# EAGLE design LI-ION Wavebubble Board (EAGLE 5.11)
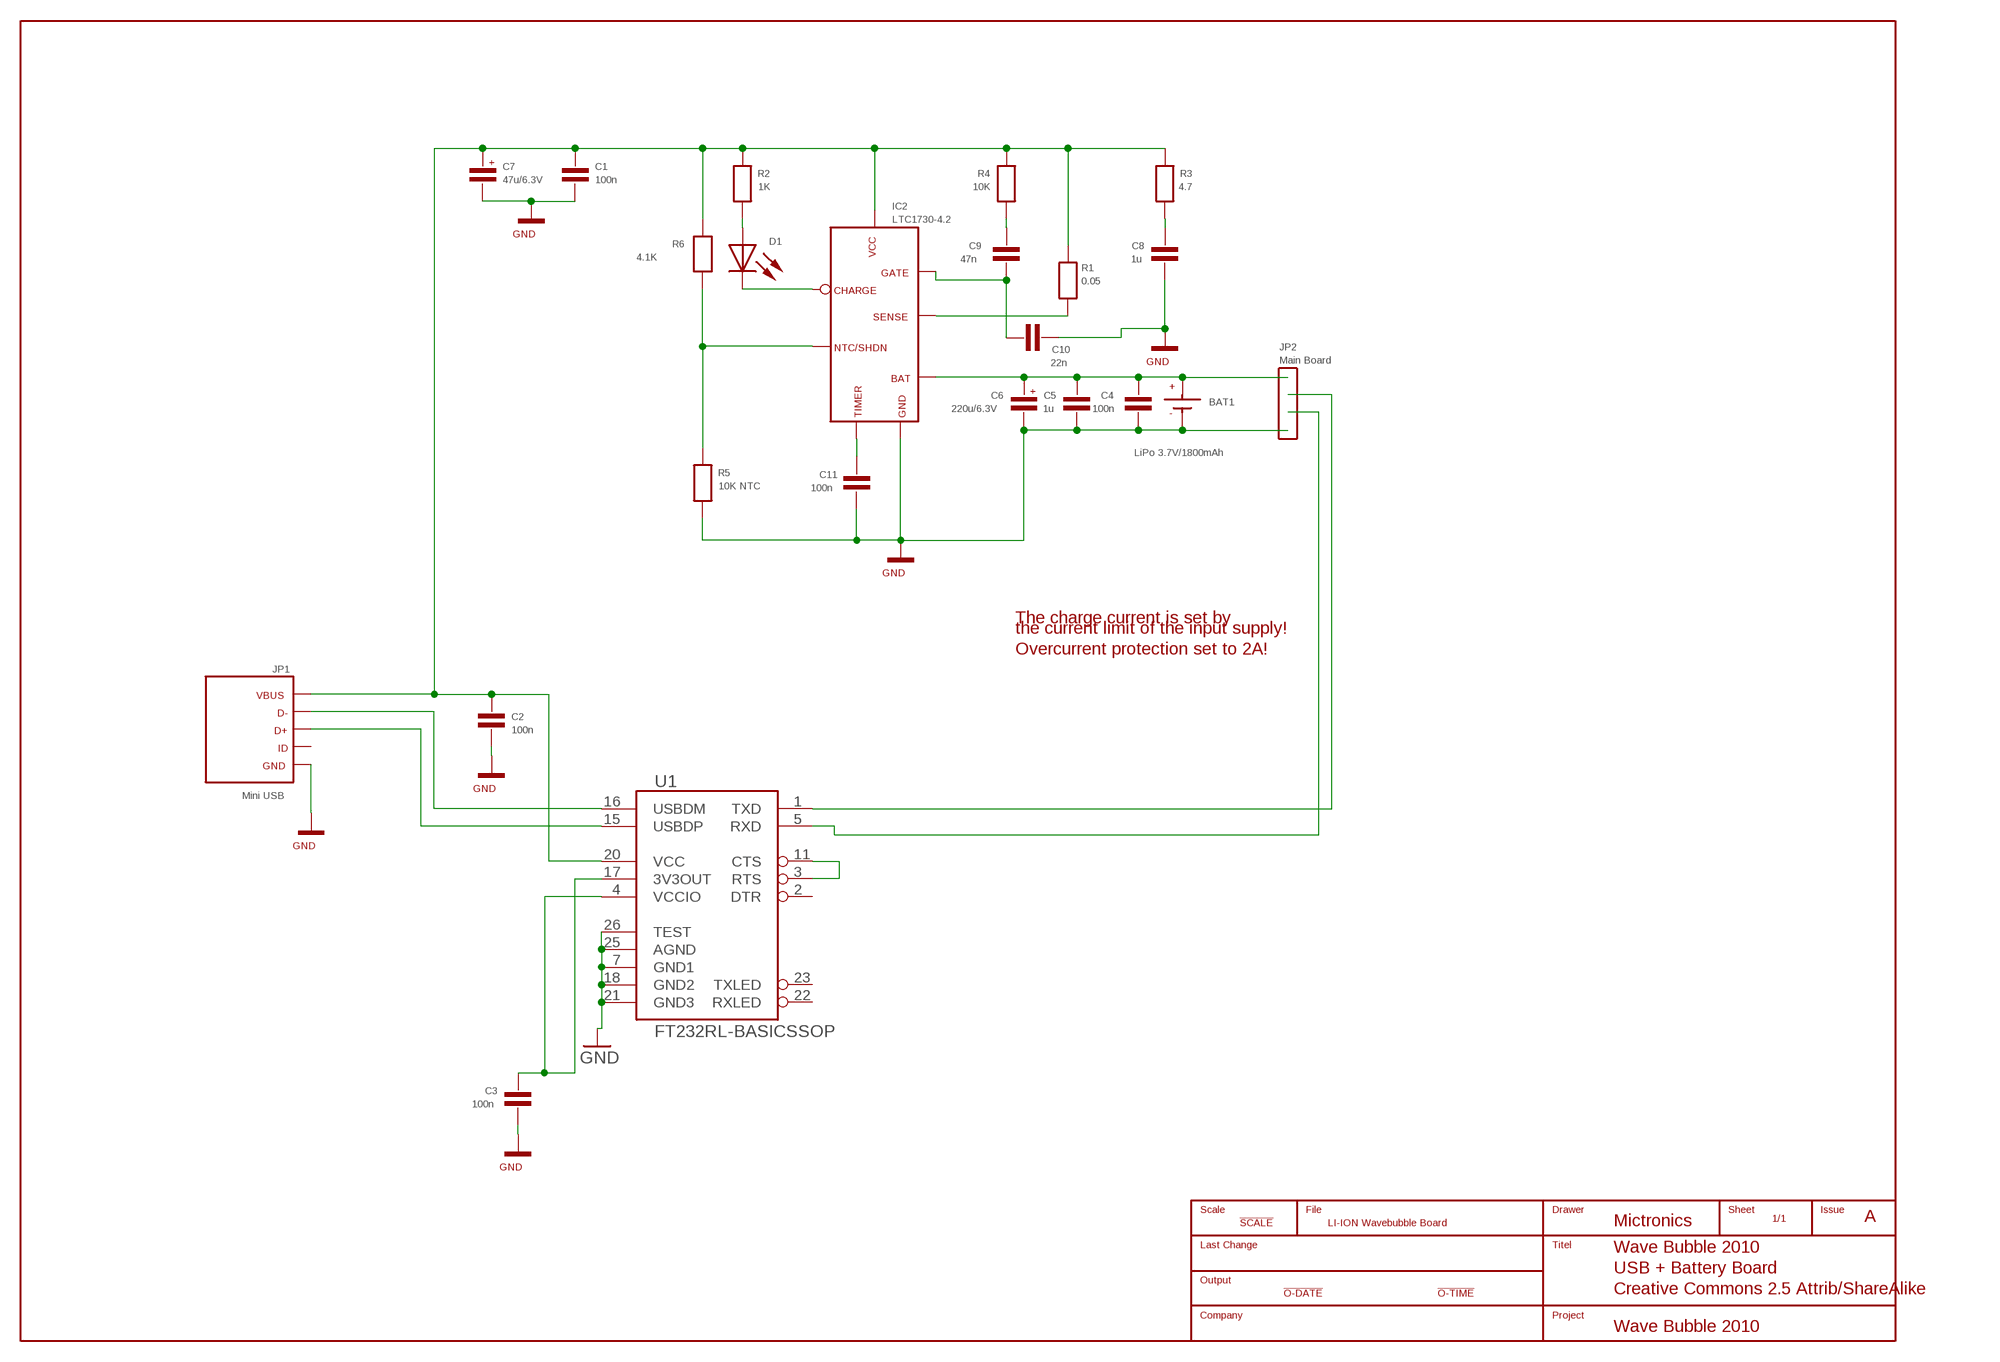
[diagram p0: schematic, sheet 1]

## Parts
BAT1  LiPo 3.7V/1800mAh  BAT1  [BAT1]
C1  100n  C1  [C1]
C2  100n  C2  [C2]
C3  100n  C3  [C3]
C4  100n  C4  [C4]
C5  1u  C5  [C5]
C6  220u/6.3V  C6  [C6]
C7  47u/6.3V  C7  [C7]
C8  1u  C8  [C8]
C9  47n  C9  [C9]
C10  22n  C10  [C10]
C11  100n  C11  [C11]
D1  GREEN  D1  [D1]
IC2  LTC1730-4.2  IC2  [IC2]
JP1  Mini USB  JP1  [JP1]
JP2  Main Board  JP2  [JP2]
R1  0.05  R1  [R1]
R2  1K  R2  [R2]
R3  4.7  R3  [R3]
R4  10K  R4  [R4]
R5  10K NTC  R5  [R5]
R6  4.1K  R6  [R6]
U1  FT232RL-BASICSSOP  [SSOP28DB]

## Nets
1: C8.1(+) R3.1
A: D1.1(A) R2.1
CEL: BAT1.1 C4.1 C5.1(+) C6.1(+) IC2.8(BAT) JP2.1
CHARGE: D1.2(K) IC2.3(CHARGE)
GND: BAT1.2 C1.2 C2.2 C3.2 C4.2 C5.2(-) C6.2(-) C7.2(-) C8.2(-) C10.2 C11.2 IC2.4(GND) JP1.5(GND) JP2.4 R5.1 U1.7(GND1) U1.18(GND2) U1.21(GND3) U1.25(AGND) U1.26(TEST) ; supply symbol labelled !GND
N$12: U1.3(RTS) U1.11(CTS)
NTC/SHDN: IC2.6(NTC/SHDN) R5.2 R6.1
RXD: JP2.3 U1.5(RXD)
SENSE: IC2.1(SENSE) R1.2
SIG$12: C9.2 C10.1 IC2.7(GATE)
SIG$13: C9.1 R4.1
TIMER: C11.1 IC2.5(TIMER)
TXD: JP2.2 U1.1(TXD)
USBDM: JP1.2(D-) U1.16(USBDM)
USBDP: JP1.3(D+) U1.15(USBDP)
VBUS: C1.1 C2.1 C7.1(+) IC2.2(VCC) JP1.1(VBUS) R1.1 R2.2 R3.2 R4.2 R6.2 U1.20(VCC)
VCCIO: C3.1 U1.4(VCCIO) U1.17(3V3OUT)
Unconnected: JP1.4(ID) U1.2(DTR) U1.22(RXLED) U1.23(TXLED)

## Notes on the sheet
- The charge current is set by
- the current limit of the input supply!
- Overcurrent protection set to 2A!
- Mictronics | A
- Wave Bubble 2010
- USB + Battery Board
- Creative Commons 2.5 Attrib/ShareAlike
- Wave Bubble 2010

## Library data of the parts
BAT1 = wave_bubble-usb_batt_LTC1730:BAT1: Akkumulator, Primärzelle, Primärelement (BATTERIE)
C1 = wave_bubble-usb_batt_LTC1730:C1: SMD VS KONDENSATOR 0.1 UF 1206 50 V SMD-Vielschicht-Keramik-Kondensatoren Nennspannung 50 V - 1 pF - 1000 pF NPO; 1200 pF -1 µF X7R. Toleranz 1 pF ... 1000 pF: 5%; 1200 pF ... 1 µF: ±10%. Baugröße 1206 ; Wert 0,1 µ
C2 = wave_bubble-usb_batt_LTC1730:C2: SMD VS KONDENSATOR 0.1 UF 1206 50 V SMD-Vielschicht-Keramik-Kondensatoren Nennspannung 50 V - 1 pF - 1000 pF NPO; 1200 pF -1 µF X7R. Toleranz 1 pF ... 1000 pF: 5%; 1200 pF ... 1 µF: ±10%. Baugröße 1206 ; Wert 0,1 µ
C3 = wave_bubble-usb_batt_LTC1730:C3: SMD VS KONDENSATOR 0.1 UF 1206 50 V SMD-Vielschicht-Keramik-Kondensatoren Nennspannung 50 V - 1 pF - 1000 pF NPO; 1200 pF -1 µF X7R. Toleranz 1 pF ... 1000 pF: 5%; 1200 pF ... 1 µF: ±10%. Baugröße 1206 ; Wert 0,1 µ
C4 = wave_bubble-usb_batt_LTC1730:C4: SMD VS KONDENSATOR 0.1 UF 1206 50 V SMD-Vielschicht-Keramik-Kondensatoren Nennspannung 50 V - 1 pF - 1000 pF NPO; 1200 pF -1 µF X7R. Toleranz 1 pF ... 1000 pF: 5%; 1200 pF ... 1 µF: ±10%. Baugröße 1206 ; Wert 0,1 µ
C5 = wave_bubble-usb_batt_LTC1730:C5: SMD ELKO TANTAL KONDENSATOR 22 UF 10% Kapazitätstoleranz bei allen Elektrolyt-Kondensatoren ±10% CN µF 22 ; UN bis 85°C V- 16 ; Baugröße C ; Typ B45196-H3226-K30
C6 = wave_bubble-usb_batt_LTC1730:C6: SMD - ELKO 100 UF/35V Miniatur SMD-Elektrolyt-Kondensatoren Sehr kleine Abm., für allgemeine Anwendung. Polaritätskennzeichnung (-) erfolgt durch einen Strich. Temperaturbereich: -40 bis +85 °C. Toleranz ±20%. µF/Volt 100/35 ; Durchmesser x H mm 10 x
C7 = wave_bubble-usb_batt_LTC1730:C7: SMD ELKO 47 UF 6.3 V Miniatur SMD-Elektrolyt-Kondensatoren Sehr kleine Abm., für allgemeine Anwendung. Polaritätskennzeichnung (-) erfolgt durch einen Strich. Temperaturbereich: -40 bis +85 °C. Toleranz ±20%. µF/Volt 47/6,3 ; Durchmesser x H mm 5,0 x 6,
C8 = wave_bubble-usb_batt_LTC1730:C8: SMD ELKO TANTAL KONDENSATOR 22 UF 10% Kapazitätstoleranz bei allen Elektrolyt-Kondensatoren ±10% CN µF 22 ; UN bis 85°C V- 16 ; Baugröße C ; Typ B45196-H3226-K30
C9 = wave_bubble-usb_batt_LTC1730:C9: SMD VS KONDENSATOR 0.1 UF 1206 50 V SMD-Vielschicht-Keramik-Kondensatoren Nennspannung 50 V - 1 pF - 1000 pF NPO; 1200 pF -1 µF X7R. Toleranz 1 pF ... 1000 pF: 5%; 1200 pF ... 1 µF: ±10%. Baugröße 1206 ; Wert 0,1 µ
C10 = wave_bubble-usb_batt_LTC1730:C10: SMD VS KONDENSATOR 0.1 UF 1206 50 V SMD-Vielschicht-Keramik-Kondensatoren Nennspannung 50 V - 1 pF - 1000 pF NPO; 1200 pF -1 µF X7R. Toleranz 1 pF ... 1000 pF: 5%; 1200 pF ... 1 µF: ±10%. Baugröße 1206 ; Wert 0,1 µ
C11 = wave_bubble-usb_batt_LTC1730:C11: SMD VS KONDENSATOR 0.1 UF 1206 50 V SMD-Vielschicht-Keramik-Kondensatoren Nennspannung 50 V - 1 pF - 1000 pF NPO; 1200 pF -1 µF X7R. Toleranz 1 pF ... 1000 pF: 5%; 1200 pF ... 1 µF: ±10%. Baugröße 1206 ; Wert 0,1 µ
D1 = wave_bubble-usb_batt_LTC1730:D1: Leuchtdiode, SMD 1206, Diffus, grün
IC2 = wave_bubble-usb_batt_LTC1730:IC2
JP1 = wave_bubble-usb_batt_LTC1730:JP1: Mini-USB-Einbaukupplung Typ B, 5-polig, abgewinkelte Ausführung, für Leiterplatten, Surface-Mount-Technik (SMT) Durchgangswiderstand = 50 mO Bemessungsstrom 0,5 A Bemessungsspannung 5 V AC Prüfspannung 100 V/60 s Isolationswiderstand = 1 GO
JP2 = wave_bubble-usb_batt_LTC1730:JP2: Buchsenleiste 4-polig RM2,54
R1 = wave_bubble-usb_batt_LTC1730:R1: SMD-Widerstand 0-Ohm
R2 = wave_bubble-usb_batt_LTC1730:R2: SMD-Widerstand 0-Ohm
R3 = wave_bubble-usb_batt_LTC1730:R3: SMD-Widerstand 0-Ohm
R4 = wave_bubble-usb_batt_LTC1730:R4: SMD-Widerstand 0-Ohm
R5 = wave_bubble-usb_batt_LTC1730:R5: SMD-Widerstand 0-Ohm
R6 = wave_bubble-usb_batt_LTC1730:R6: SMD-Widerstand 0-Ohm
U1 = SparkFun:FT232RL-BASIC: USB UART This is the simplified version of the FT232RL unit. Only what you need, nothing you don't. Spark Fun Electronics SKU : COM-00650

## Board
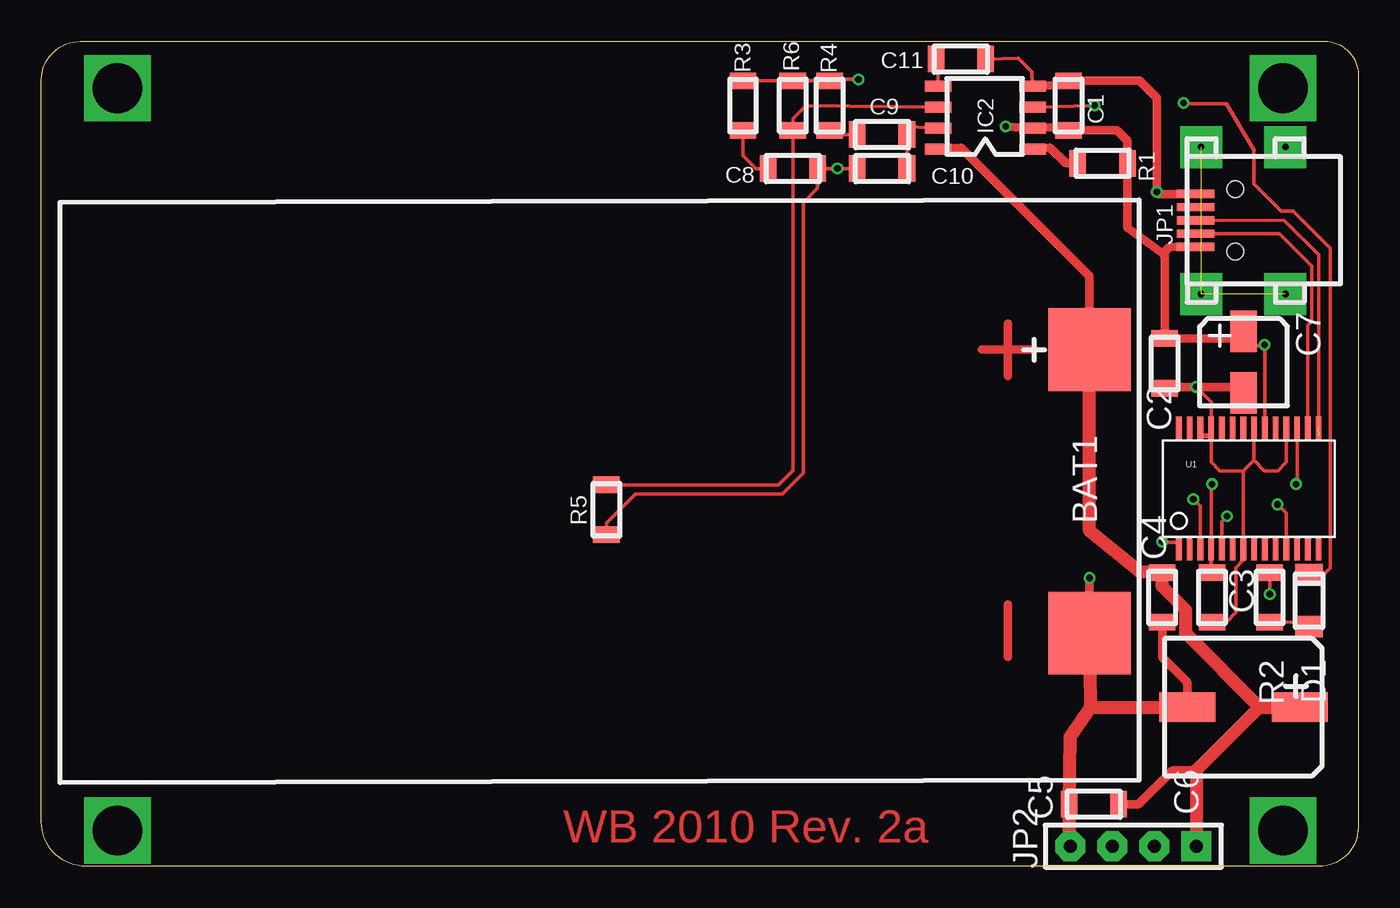
[diagram p1: board, top side]
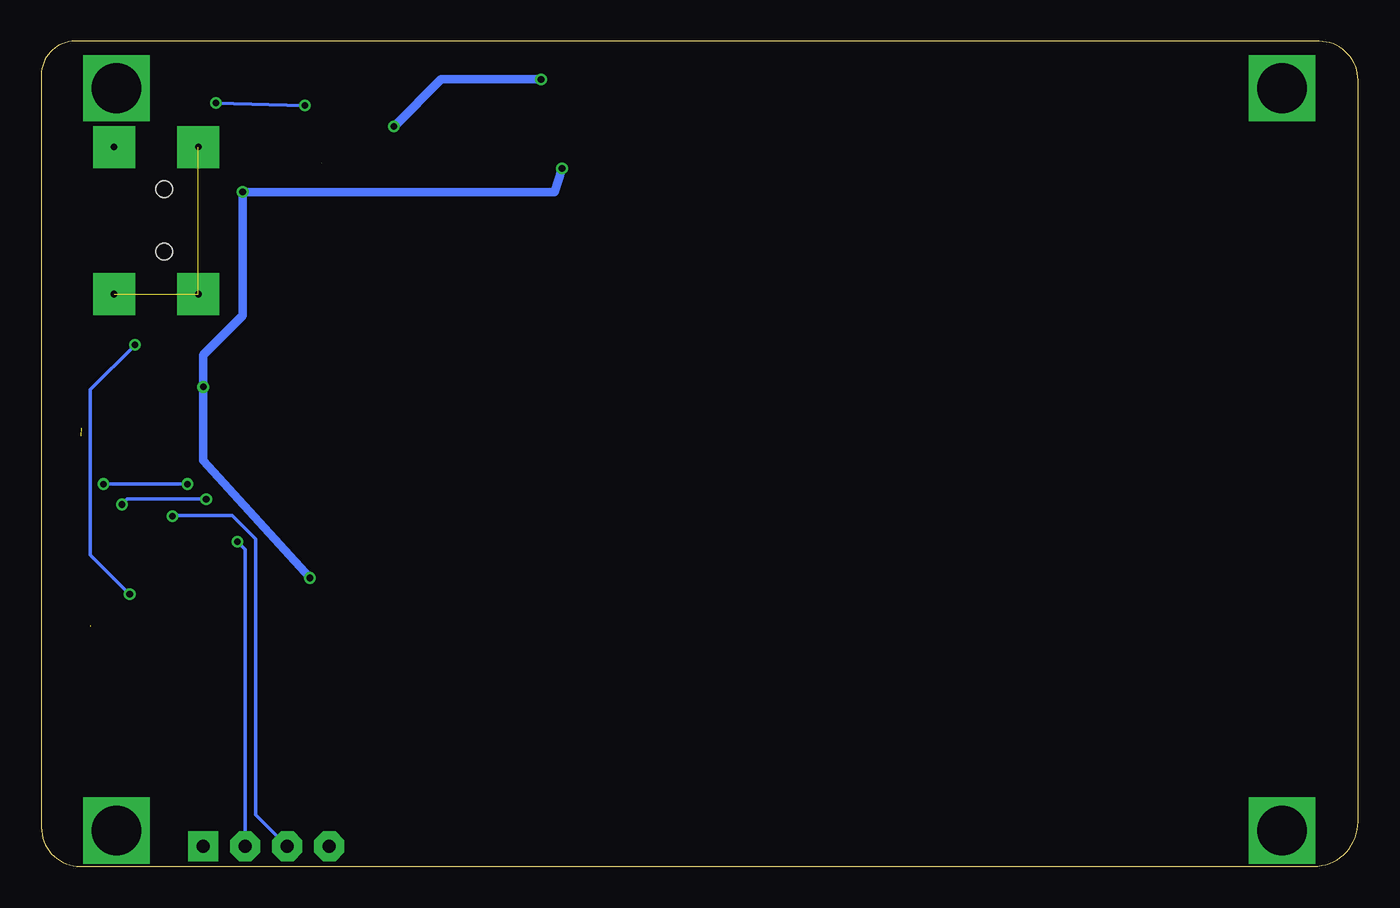
[diagram p2: board, bottom side, seen from below]

Size 79.64 x 49.9 mm. Coordinates in mm from the lower left corner, seen from the top.
Outline: 0,47.54 arc-90 2.36,49.9 77.62,49.9 arc-90 79.64,47.88 79.64,2.35 arc-90 77.29,0 2.69,0 arc-90 0,2.69 0,47.54
Copper layers (1*16): Top 0.035mm / dielectric 1.5mm / Bottom 0.035mm
Design rules "ITead_rule": minimum track width 6mil, minimum drill 12mil, track to track 6mil, track to pad 6mil, pad to pad 6mil, via to via 6mil, smd to smd 0mil, copper to edge 10mil, drill to drill 10mil, minimum pad ring 10mil, minimum via ring 6mil, stop-mask expansion 2mil, vias tented up to drill 100mil, thermal gap 10mil

### Footprints (pad centres in the part's own frame; a part is rotated, then mirrored left to right if it is on the bottom)
BAT1 = smd 5 x 5: 1 9.684,-29.21; 2 -7.461,-29.21
C1 = smd 1 x 1.6: 1 -1.5,0; 2 1.5,0
C2 = smd 1 x 1.6: 1 1.5,0; 2 -1.5,0
C3 = smd 1 x 1.6: 1 1.5,0; 2 -1.5,0
C4 = smd 1 x 1.6: 1 1.5,0; 2 -1.5,0
C5 = smd 1.6 x 1: 1 0,-1.5; 2 0,1.5
C6 = smd 1.8 x 3.4: 1 0,-3.4; 2 0,3.4
C7 = smd 2.5 x 1.6: 1 1.865,0; 2 -1.865,0
C8 = smd 1.6 x 1: 1 0,1.5; 2 0,-1.5
C9 = smd 1.6 x 1: 1 0,1.5; 2 0,-1.5
C10 = smd 1.6 x 1: 1 0,-1.5; 2 0,1.5
C11 = smd 1.6 x 1: 1 0,1.5; 2 0,-1.5
D1 = smd 1.315 x 1.68: 1 -1.567,0; 2 1.567,0
IC2 = smd 0.65 x 1.6: 1 0,0; 2 1.27,0; 3 2.54,0; 4 3.81,0; 5 3.81,5.715; 6 2.54,5.715; 7 1.27,5.715; 8 0,5.715
JP1 = smd 0.5 x 2.25: 1 0,0; 2 0.8,0; 3 1.6,0; 4 2.4,0; 5 3.2,0 | hole 1: 3.482,-2.4; -0.282,-2.4
JP2 = drill 0.8 pad 1.8 square: 1 0,-3.81 | drill 0.8 pad 1.8 octagon: 2 0,-1.27; 3 0,1.27; 4 0,3.81
R1 = smd 1.6 x 1: 1 0,-1.5; 2 0,1.5
R2 = smd 1 x 1.6: 1 -1.5,0; 2 1.5,0
R3 = smd 1 x 1.6: 1 -1.5,0; 2 1.5,0
R4 = smd 1 x 1.6: 1 -1.5,0; 2 1.5,0
R5 = smd 1 x 1.6: 1 -1.5,0; 2 1.5,0
R6 = smd 1 x 1.6: 1 -1.5,0; 2 1.5,0
SSOP28DB = smd 0.348 x 1.397: 1 -4.225,-3.656; 2 -3.575,-3.656; 3 -2.925,-3.656; 4 -2.275,-3.656; 5 -1.625,-3.656; 6 -0.975,-3.656; 7 -0.325,-3.656; 8 0.325,-3.656; 9 0.975,-3.656; 10 1.625,-3.656; 11 2.275,-3.656; 12 2.925,-3.656; 13 3.575,-3.656; 14 4.225,-3.656; 15 4.225,3.656; 16 3.575,3.656; 17 2.925,3.656; 18 2.275,3.656; 19 1.625,3.656; 20 0.975,3.656; 21 0.325,3.656; 22 -0.325,3.656; 23 -0.975,3.656; 24 -1.625,3.656; 25 -2.275,3.656; 26 -2.925,3.656; 27 -3.575,3.656; 28 -4.225,3.656

### Placement (x,y rotation side)
BAT1  34.18,21.57 90 top
C1  62.12,46.01 90 top
C2  67.94,30.42 90 top
C3  70.8,16.26 90 top
C4  67.79,16.26 90 top
C5  63.66,3.75 90 top
C6  72.71,9.62 90 top
C7  72.71,30.5 90 top
C8  45.45,42.2 90 top
C9  50.85,44.27 90 top
C10  50.85,42.2 90 top
C11  55.61,48.82 90 top
D1  76.68,16.06 90 top
IC2  59.95,43.37 90 top
JP1  69.81,37.47 90 top
JP2  66.04,1.21 90 top
R1  64.19,42.52 90 top
R2  74.29,16.26 90 top
R3  42.44,46.01 90 top
R4  47.68,46.01 90 top
R5  34.18,21.57 90 top
R6  45.45,46.01 90 top
U1  73.01,22.84 0 top

### Tracks (layer width: path | path; a pad name or v marks a point on that pad's centre or on a via)
1
  Top 0.203: R3.1 42.44,43 43.23,42.2 C8.1
A  (1 unrouted)
  Top 0.203: 74.36,14.72 R2.1 76.45,14.79 76.68,14.57
CEL
  Top 0.5: 69.85,5.81 68.42,5.81 66.36,3.75 C5.1 | BAT1.1 63.39,35.7 55.61,43.47 IC2.8
  Top 0.8: 73.66,9.62 C6.1 | 73.66,9.62 69.85,5.81 JP2.1 | 73.66,9.62 69.21,14.07 69.21,15.5 67.79,16.93 C4.1 66.44,17.79 63.39,20.3 BAT1.1
CHARGE  (via drill 0.4)
  Top 0.203: v63.71,46.01 IC2.3 | D1.2 77.61,17.7 77.95,18.04 77.95,37.41 75.72,39.63 74.99,39.63 73.33,41.29 73.33,43.35 71.66,46.14 69.06,46.14 v69.08,46.16
  Bottom 0.203: v69.08,46.16 v63.71,46.01
GND  (via drill 0.4)
  Top 0.203: 70.75,26.02 70.75,24.44 71.28,23.91 72.71,23.91 | 72.71,23.91 72.7,23.91 72.7,18.52 | 72.7,18.52 72.23,18.05 72.23,15.34 71.68,14.79 C3.2 | IC2.4 59.9,48.08 59.1,48.87 C11.2 | R5.1 34.18,20.77 35.93,22.52 44.82,22.52 46.09,23.79 46.09,40.14 46.95,41.01 C8.2 v48.15,42.2 C10.2 | 73.35,24.54 73.98,23.91 74.77,23.91 75.3,24.44 75.3,26.02 75.29,26.03 U1.18 | 72.71,23.91 73.33,24.54 73.35,24.54 | v69.85,28.99 70.75,28.09 70.75,26.02 | 72.7,18.52 72.69,18.53 U1.7 | U1.26 70.15,26.43 70.15,26.02 | 70.75,26.02 70.74,26.03 U1.25 | 73.35,26.02 73.34,26.03 U1.21 73.34,24.55 73.35,24.54
  Top 0.3: 70.75,26.02 70.15,26.02 70.1,26.02
  Top 0.5: C7.2 72.27,28.99 v69.85,28.99 68.02,28.99 C2.2 | 62.16,1.28 JP2.4 | C6.2 69.31,11.12 67.79,12.64 C4.2 | v63.39,17.44 BAT1.2 | IC2.4 61.89,47.28 C1.2 66.44,47.51 67.47,46.49 v67.47,40.79 67.55,40.66 JP1.5
  Top 0.8: BAT1.2 63.44,9.62 | 63.44,9.62 C6.2 | 63.44,9.62 62.21,7.84 C5.2 62.16,1.28
  Bottom 0.5: v63.39,17.44 69.85,24.55 v69.85,28.99 69.85,30.93 67.47,33.32 v67.47,40.79 48.62,40.79 v48.15,42.2
N$1  (via drill 3)
  other vias: 4.6,2.16
N$2  (via drill 3)
  other vias: 4.6,47.07
N$3  (via drill 3)
  other vias: 75.09,2.16
N$4  (via drill 3)
  other vias: 75.09,47.07
N$5
  Top 0.5: 56.88,31.25 60.06,31.25
N$6
  Top 0.5: 58.47,29.66 58.47,32.84
N$7
  Top 0.5: 58.47,12.68 58.47,15.85
N$8  (via drill 0.4 pad 2.54)
  other vias: 75.24,43.51
N$9  (via drill 0.4 pad 2.54)  (2 unrouted)
  other vias: 70.15,43.51 70.15,34.61 75.24,34.61
N$12  (via drill 0.4)
  Top 0.203: U1.3 70.09,21.79 v69.67,22.21 | v74.76,21.89 75.29,21.36 U1.11
  Bottom 0.203: v69.67,22.21 74.44,22.21 v74.76,21.89
NTC/SHDN
  Top 0.203: IC2.6 46.25,46.01 45.45,45.22 R6.1 45.45,23.95 44.57,23.07 R5.2
RXD  (via drill 0.4)
  Top 0.203: 71.4,19.2 U1.5 71.39,20.85 v71.72,21.18
  Bottom 0.203: JP2.3 66.67,3.12 66.67,19.79 68.1,21.21 71.36,21.21 v71.72,21.18 71.44,21.21
SENSE  (1 unrouted)
  Top 0.5: R1.2 61.96,42.52 61.01,43.47 IC2.1
SIG$12
  Top 0.203: IC2.7 52.44,44.74 52.35,44.66 C9.2 C10.1
SIG$13
  Top 0.203: C9.1 47.92,44.27 R4.1
TIMER
  Top 0.203: IC2.5 54.18,48.8 C11.1
TXD  (via drill 0.4)
  Top 0.203: v67.79,19.63 67.83,19.58 68.8,19.58 68.79,19.57 U1.1
  Bottom 0.203: v67.79,19.63 67.31,19.15 JP2.2
USBDM
  Top 0.203: JP1.2 74.87,38.26 76.83,36.3 76.83,32.96 76.6,32.73 76.6,26.02 76.59,26.03 U1.16
USBDP  (1 unrouted)
  Top 0.203: 77.25,26.02 77.25,36.99 75.18,39.06 JP1.3
VBUS  (via drill 0.4)
  Top 0.203: 74,31.51 U1.20 | v74.29,16.45 R2.2 | R4.2 R6.2 R3.2 | 47.76,47.6 v49.42,47.6 | 74,31.51 73.48,31.51 C7.1 | 74,31.51 v73.98,31.53 | U1.20 | U1.20 74,26.02
  Top 0.5: C7.1 72.34,31.92 C2.1 67.94,36.93 67.83,37.05 | 67.83,37.05 65.69,38.64 R1.1 65.69,43.88 65.05,44.51 C1.1 61.89,44.74 IC2.2 v58.31,44.74 | R4.2 47.76,47.6 | JP1.1 68.23,37.46 67.83,37.05
  Bottom 0.203: v73.98,31.53 76.68,28.83 76.68,18.83 v74.29,16.45
  Bottom 0.5: v58.31,44.74 55.45,47.6 v49.42,47.6
VCCIO  (via drill 0.4)
  Top 0.203: 70.75,17.84 C3.1 | 70.75,17.84 70.75,23.07 v70.8,23.12 | v75.88,23.12 75.95,23.19 75.95,26.02 75.94,26.03 U1.17 | 70.75,17.84 70.74,17.86 U1.4
  Bottom 0.203: v70.8,23.12 v75.88,23.12

### Text on the board
Top: WB 2010 Rev. 2a